# Altium schematic sheet v1.0.SchDoc
size 177 x 99 mm
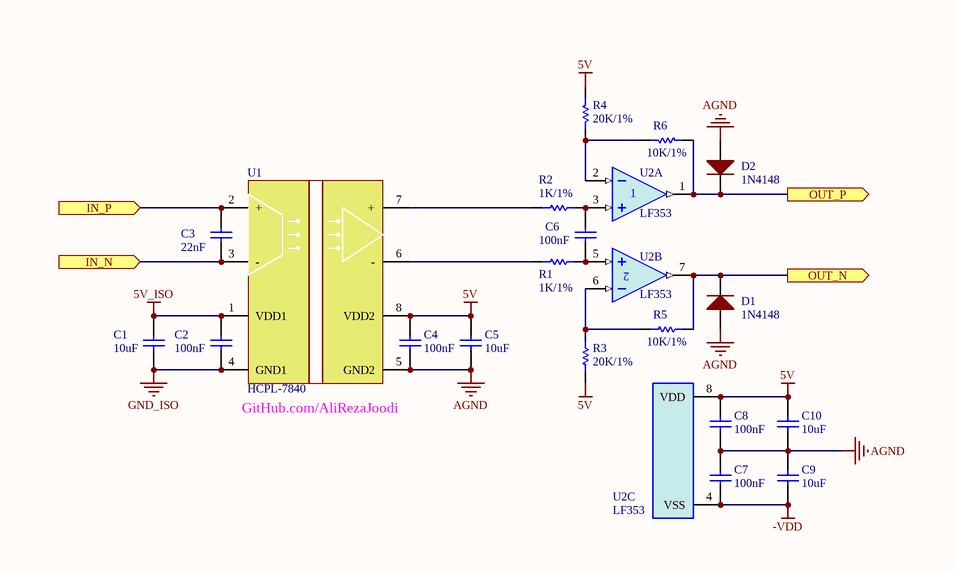
[diagram p0: v1.0.SchDoc]

## Parts
C1  10uF  [SMD_0805]
C2  100nF  [SMD_0805]
C3  22nF  [SMD_0805]
C4  100nF  [SMD_0805]
C5  10uF  [SMD_0805]
C6  100nF  [SMD_0805]
C7  100nF  [SMD_0805]
C8  100nF  [SMD_0805]
C9  10uF  [SMD_0805]
C10  10uF  [SMD_0805]
D1  1N4148  [SMD_DO-213AA]
D2  1N4148  [SMD_DO-213AA]
R1  1K/1%  [SMD_0805]
R2  1K/1%  [SMD_0805]
R3  20K/1%  [SMD_0805]
R4  20K/1%  [SMD_0805]
R5  10K/1%  [SMD_0805]
R6  10K/1%  [SMD_0805]
U1  HCPL-7840  [DIP_8]
U2  LF353  [SOIC127P600-8CM]  (parts A,B,C of 3)

## Ports
IN_N (in), IN_P (in), OUT_N (out), OUT_P (out)

## Nets
5V: C4.2 C5.1 C8.2 C10.1 R3.2 R4.2 U1.8(VDD2) U2.8(VDD)
5V_ISO: C1.1 C2.2 U1.1(VDD1)
-VDD: C7.1 C9.2 U2.4(VSS)
AGND: C4.1 C5.2 C7.2 C8.1 C9.1 C10.2 D1.1(A) D2.1(A) U1.5(GND2)
GND_ISO: C1.2 C2.1 U1.4(GND1)
IN_N: C3.2 U1.3(-) ; port IN_N
IN_P: C3.1 U1.2(+) ; port IN_P
OUT_N: D1.2(K) R5.1 U2.7(OUT) ; port OUT_N
OUT_P: D2.2(K) R6.1 U2.1(OUT) ; port OUT_P
NetC6_1: C6.1 R1.1 U2.5(IN+)
NetC6_2: C6.2 R2.1 U2.3(IN+)
NetR1_2: R1.2 U1.6(-)
NetR2_2: R2.2 U1.7(+)
NetR3_1: R3.1 R5.2 U2.6(IN-)
NetR4_1: R4.1 R6.2 U2.2(IN-)

## Notes on the sheet
- (near U1) GitHub.com/AliRezaJoodi

## Library data of the parts
C1-C10 = Capacitor_Ceramic: Capacitor, Ceramic Multilayer, 25V, 10%; Revision: July-2002: Re-released for DXP Platform.
D1 D2 = Diode_2Form: Diode; Manufacturer: Microchip Technology; Part Number: 1N4148UR-1; Link: https://eu.mouser.com/ProductDetail/Microchip-Technology/1N4148UR-1?qs=%252BRKXB2WKlSdXiNZTe6I9fg%3D%3D
R1-R6 = Resistor: Resistor, 1/8W, 1%; Revision: July-2002: Re-released for DXP Platform.
U1 = HCPL-7840: Isolation Amplifier; 1_Manufacturer: Broadcom / Avago; 1_Link: https://eu.mouser.com/ProductDetail/Broadcom-Avago/HCPL-7840?qs=s%252BgfxR24RQ5HKWShvQLiBg%3D%3D; 1_Part Number: HCPL-7840
U2 = Op-Amp_Form1: IC, Op-Amp; Manufacturer: Texas Instruments; Part Number: LF353P; Link: https://eu.mouser.com/ProductDetail/Texas-Instruments/LF353P?qs=EIjG%252BN7kn%252BnHJN43AgArjw%3D%3D